# Altium schematic sheet [F_V1]_PowerSheet.SchDoc
size A2; SheetNumber: 2; SheetTotal: 5
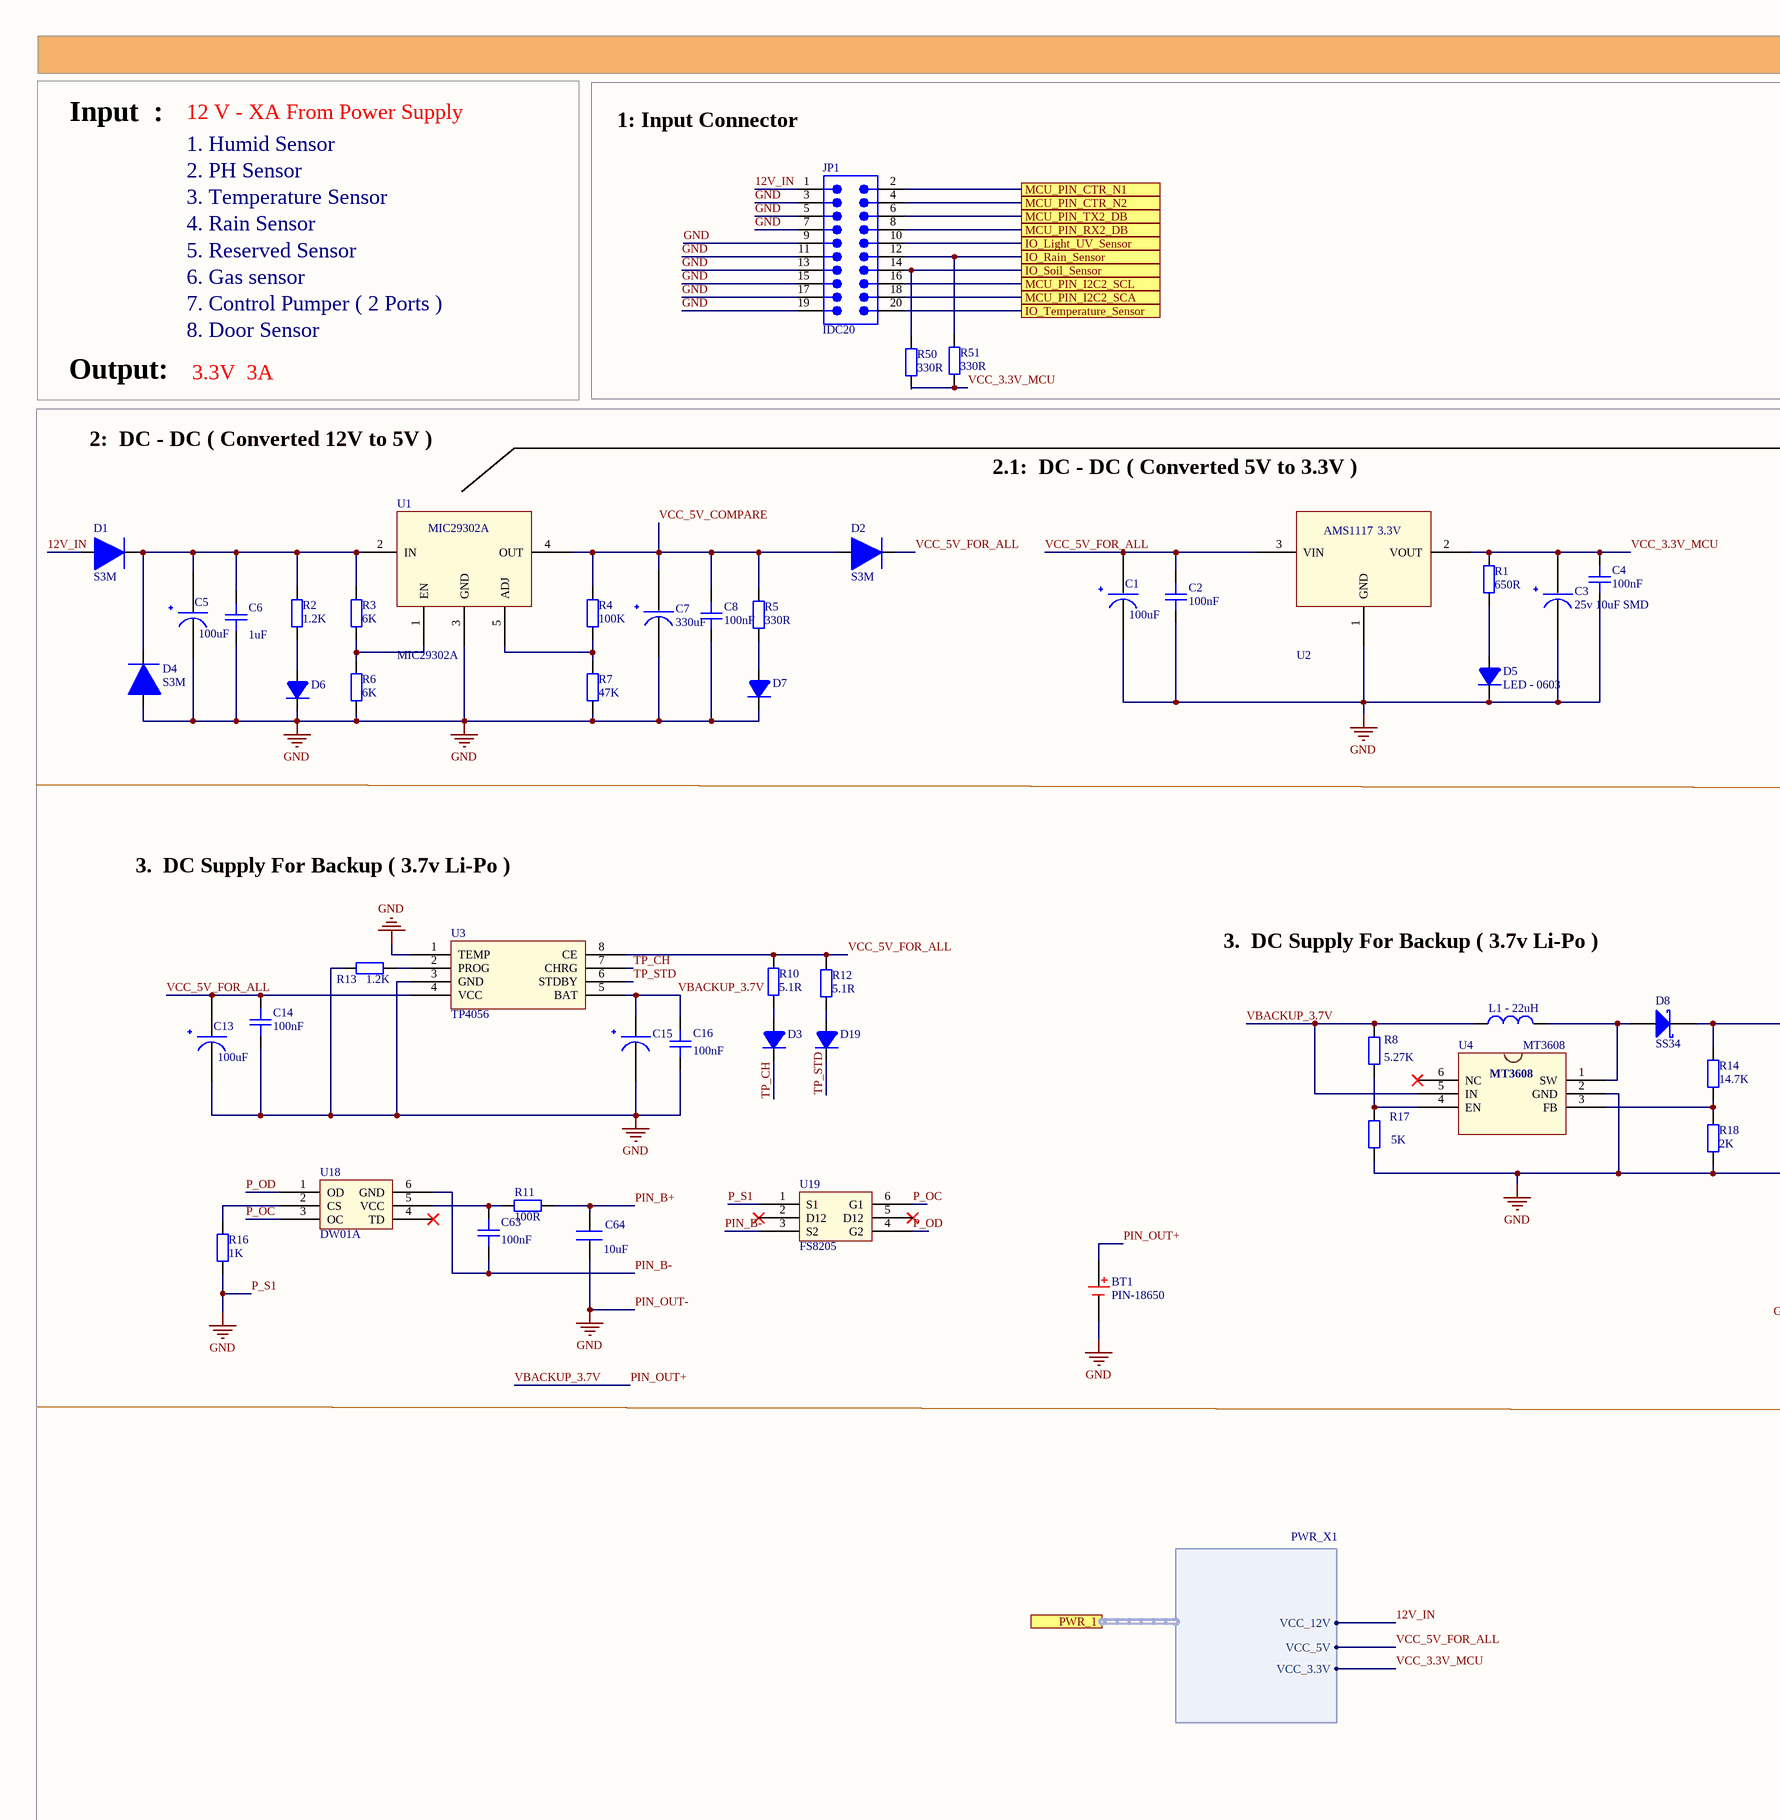
[diagram p0: [F_V1]_PowerSheet.SchDoc, left]
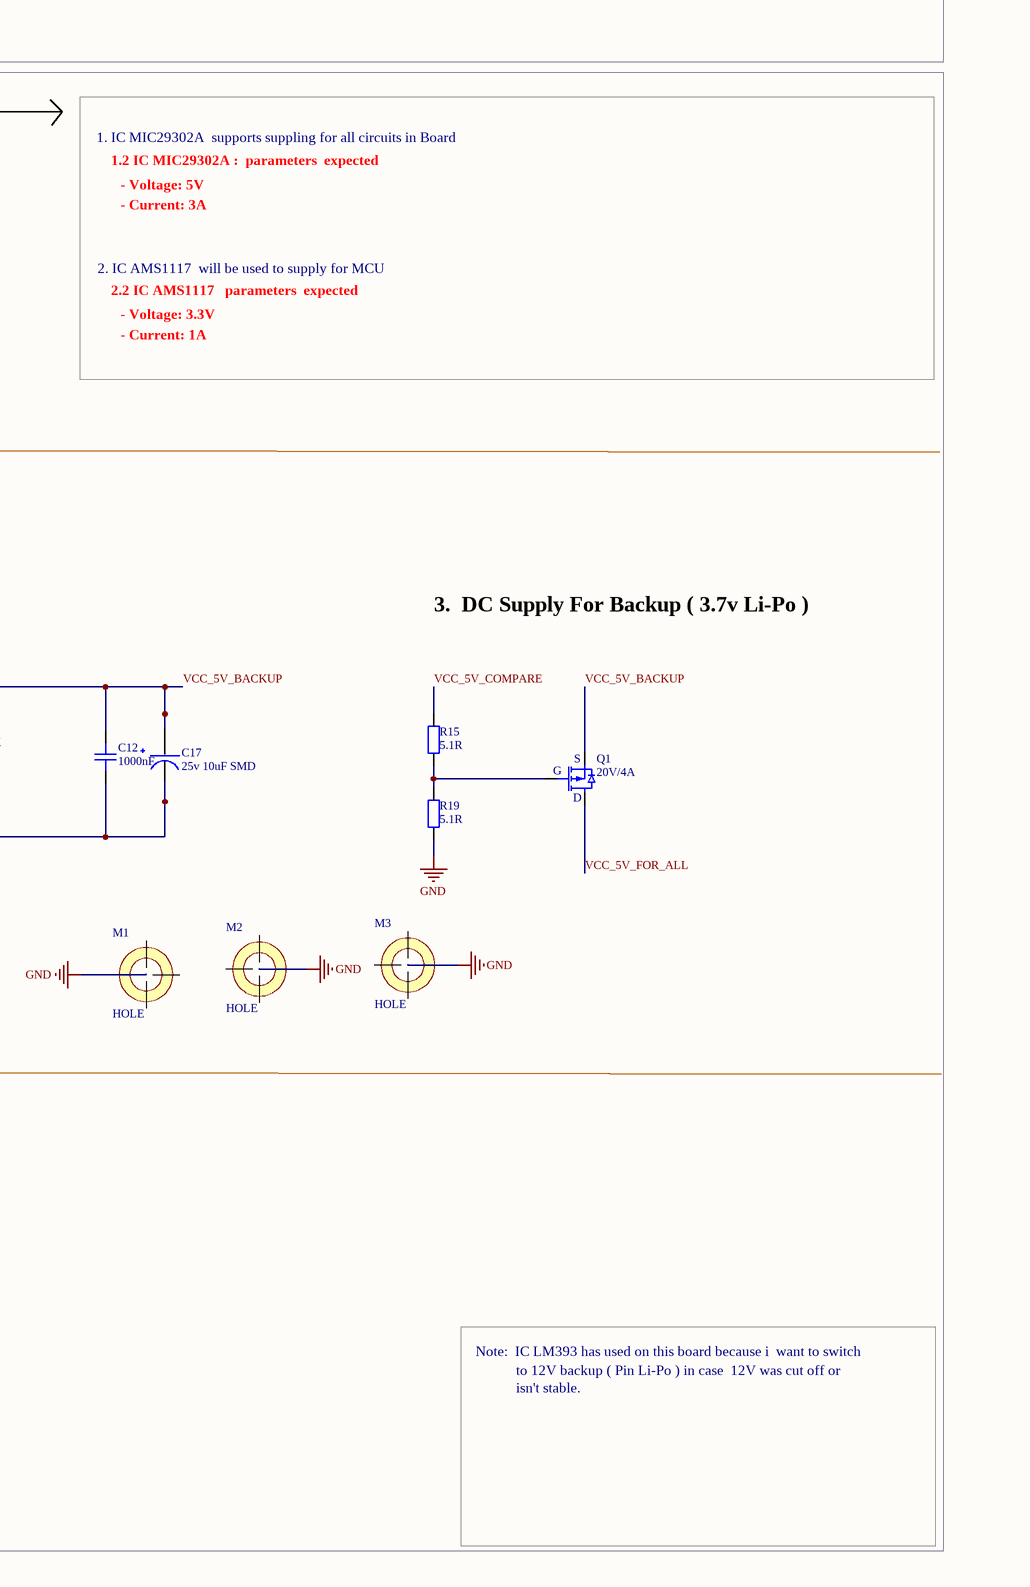
[diagram p1: [F_V1]_PowerSheet.SchDoc, right]

## Parts
BT1  PIN-18650  [PIN]
C1  100uF  [CAPACITOR 6.3x7.7mm]
C2  100nF  [CAPC-0603 (1608)]
C3  25v 10uF SMD  [CAPACITOR 4x5.4mm]
C4  100nF  [CAPC-0603 (1608)]
C5  100uF  [CAPACITOR 6.3x7.7mm]
C6  1uF  [CAPC-0603 (1608)]
C7  330uF  [CAPACITOR 8x10mm SMD]
C8  100nF  [CAPC-0603 (1608)]
C12  1000nF  [CAPC-0603 (1608)]
C13  100uF  [CAPACITOR 6.3x7.7mm]
C14  100nF  [CAPC-0603 (1608)]
C15  25v 10uF SMD  [CAPACITOR 4x5.4mm]  (value not drawn)
C16  100nF  [CAPC-0603 (1608)]
C17  25v 10uF SMD  [CAPACITOR 4x5.4mm]
C63  100nF  [CAPC-0603 (1608)]
C64  10uF  [CAP 10uF SMD 0805]
D1  S3M  [S3M]
D2  S3M  [S3M]
D3  LED - 0603  [LED - 0603]  (value not drawn)
D4  S3M  [S3M]
D5  LED - 0603  [LED - 0603]
D6  LED - 0603  [LED - 0603]  (value not drawn)
D7  LED - 0603  [LED - 0603]  (value not drawn)
D8  SS34  [DIODE_DO214AC_SMA]
D19  LED - 0603  [LED - 0603]  (value not drawn)
JP1  IDC20  [CAPBLE 20]
L1_-_22uH  L-22uH-0530  [INDUCTOR-0630-SMD]  (value not drawn)
M1  HOLE  [HOLE_2MM_5MM]  (no BOM)
M2  HOLE  [HOLE_2MM_5MM]  (no BOM)
M3  HOLE  [HOLE_2MM_5MM]  (no BOM)
Q1  20V/4A  [SOT23_3]
R1  650R  [RESC-0603 (1608)]
R2  1.2K  [RESC-0603 (1608)]
R3  6K  [RESC-0603 (1608)]
R4  100K  [RESC-0603 (1608)]
R5  330R  [RESC-0603 (1608)]
R6  6K  [RESC-0603 (1608)]
R7  47K  [RESC-0603 (1608)]
R8  5.27K  [RESC-0603 (1608)]
R10  5.1R  [RESC-0603 (1608)]
R11  100R  [RESC-0603 (1608)]
R12  5.1R  [RESC-0603 (1608)]
R13  1.2K  [RESC-0603 (1608)]
R14  14.7K  [RESC-0603 (1608)]
R15  5.1R  [RESC-0603 (1608)]
R16  1K  [RESC-0603 (1608)]
R17  5K  [RESC-0603 (1608)]
R18  2K  [RESC-0603 (1608)]
R19  5.1R  [RESC-0603 (1608)]
R50  330R  [RESC-0603 (1608)]
R51  330R  [RESC-0603 (1608)]
U1  MIC29302A  [MIC29302A]
U2  AMS1117 - 3.3V  [AMS1117 -3.3V]  (value not drawn)
U3  TP4056  [TP4056]
U4  MT3608  [MT3608]
U18  DW01A  [DW01A]
U19  FS8205  [FS8205]

## Blocks framed on the sheet
1: Input Connector: JP1 R50 R51

## Ports
IO_Light_UV_Sensor, IO_Rain_Sensor, IO_Soil_Sensor, IO_Temperature_Sensor, MCU_PIN_CTR_N1, MCU_PIN_CTR_N2, MCU_PIN_I2C2_SCA, MCU_PIN_I2C2_SCL, MCU_PIN_RX2_DB, MCU_PIN_TX2_DB, PWR_1 (harness PWR_X1)

## Harnesses
PWR_X1: VCC_12V, VCC_5V, VCC_3.3V

## Nets
GND: BT1.2 C1.2 C2.1 C3.2 C4.1 C5.2 C6.1 C7.2 C8.1 C12.1 C13.2 C14.1 C15.2 C16.1 C17.2 C64.1 D4.1(A) D5.2(K) D6.2(K) D7.2(K) JP1.3 JP1.5 JP1.7 JP1.9 JP1.11 JP1.13 JP1.15 JP1.17 JP1.19 R6.1 R7.1 R13.1 R16.2 R17.2 R18.2 R19.1 U1.3(GND) U2.1(GND) U3.1(TEMP) U3.3(GND) U4.2(GND) U19.1(S1)  [also labelled P_S1, PIN_OUT-]
12V_IN: D1.1(A) JP1.1 ; port PWR_1.VCC_12V
IO_Light_UV_Sensor: JP1.10 ; port IO_Light_UV_Sensor
IO_Rain_Sensor: JP1.12 R51.2 ; port IO_Rain_Sensor
IO_Soil_Sensor: JP1.14 R50.2 ; port IO_Soil_Sensor
IO_Temperature_Sensor: JP1.20 ; port IO_Temperature_Sensor
MCU_PIN_CTR_N1: JP1.2 ; port MCU_PIN_CTR_N1
MCU_PIN_CTR_N2: JP1.4 ; port MCU_PIN_CTR_N2
MCU_PIN_I2C2_SCA: JP1.18 ; port MCU_PIN_I2C2_SCA
MCU_PIN_I2C2_SCL: JP1.16 ; port MCU_PIN_I2C2_SCL
MCU_PIN_RX2_DB: JP1.8 ; port MCU_PIN_RX2_DB
MCU_PIN_TX2_DB: JP1.6 ; port MCU_PIN_TX2_DB
P_OC: U18.3(OC) U19.6(G1)
P_OD: U18.1(OD) U19.4(G2)
PIN_B+: C64.2 R11.2
PIN_B-: C63.1 U18.6(GND) U19.3(S2)
PIN_OUT+: BT1.1 C15.1 C16.2 L1_-_22uH.1 R8.1 U3.5(BAT) U4.5(IN)  [also labelled VBACKUP_3.7V]
TP_CH: D3.2(K) U3.7(CHRG)
TP_STD: D19.2(K) U3.6(STDBY)
VCC_3.3V_MCU: C3.1 C4.2 R1.2 R50.1 R51.1 U2.2(VOUT) ; port PWR_1.VCC_3.3V
VCC_5V_BACKUP: C12.2 C17.1 D8.2(K) Q1.2(S) R14.1
VCC_5V_COMPARE: C7.1 C8.2 D2.1(A) R4.1 R5.2 R15.1 U1.4(OUT)
VCC_5V_FOR_ALL: C1.1 C2.2 C13.1 C14.2 D2.2(K) Q1.3(D) R10.2 R12.2 U2.3(VIN) U3.4(VCC) U3.8(CE) ; port PWR_1.VCC_5V
NetC5_1: C5.1 C6.2 D1.2(K) D4.2(K) R2.2 R3.1 U1.2(IN)
NetC63_2: C63.2 R11.1 U18.5(VCC)
NetD3_1: D3.1(A) R10.1
NetD5_1: D5.1(A) R1.1
NetD6_1: D6.1(A) R2.1
NetD7_1: D7.1(A) R5.1
NetD8_1: D8.1(A) L1_-_22uH.2 U4.1(SW)
NetD19_1: D19.1(A) R12.1
NetQ1_1: Q1.1(G) R15.2 R19.2
NetR3_2: R3.2 R6.2 U1.1(EN)
NetR4_2: R4.2 R7.2 U1.5(ADJ)
NetR8_2: R8.2 R17.1 U4.4(EN)
NetR13_2: R13.2 U3.2(PROG)
NetR14_2: R14.2 R18.1 U4.3(FB)
NetR16_1: R16.1 U18.2(CS)

Not connected (* = marked no-connect by the designer): U4 6(NC)*; U18 4(TD)*; U19 2(D12)* 5(D12)*

## Notes on the sheet
- Input  :
- 12 V - XA From Power Supply
- 1. Humid Sensor
- 2. PH Sensor
- 3. Temperature Sensor
- 4. Rain Sensor
- 5. Reserved Sensor
- 6. Gas sensor
- 7. Control Pumper ( 2 Ports )
- Output:
- 8. Door Sensor
- 3.3V  3A
- 2:  DC - DC ( Converted 12V to 5V )
- 2.1:  DC - DC ( Converted 5V to 3.3V )
- 1. IC MIC29302A  supports suppling for all circuits in Board
- 1.2 IC MIC29302A :  parameters  expected
- - Voltage: 5V
- - Current: 3A
- 2. IC AMS1117  will be used to supply for MCU
- 2.2 IC AMS1117   parameters  expected
- - Voltage: 3.3V
- - Current: 1A
- 3.  DC Supply For Backup ( 3.7v Li-Po )
- Note:  IC LM393 has used on this board because i  want to switch
- to 12V backup ( Pin Li-Po ) in case  12V was cut off or
- isn't stable.
- (in symbol AMS1117 - 3.3V) AMS1117; 3.3V

## Library data of the parts
C1 C5 C13 = 25V 100uF SMD
C2 C4 C6 C8 C12 C14 C16 C63 = CAPC NF 0603: CAP SMD, Not Fill, 0603; Value: NF; Solder: Not Fill; Category: CAPACITOR
C7 = 25V 330uF SMD
C64 = CAP 0805 10uF SMD
D8 = SS34: DIODE SCHOTTKY 40V 3A SMA; Solder: SMT; MPN: SS34; Value: SS34; MFR: *
JP1 = CAPBLE 20: Flat Cable Connector (IDC), Standard Male Header, Straight Press-in Pin, 20 Contacts, Performance Level 2; PCB_Layout: Complies with manufacturer's recommendation.; DrillSize: Corresponds to nominal value.; Published: 15-Nov-2004; PackageDocument: Feb-2000; PackageReference: 918520x329; Publisher: Altium Limited; ComponentLink1Description: Manufacturer Link; ComponentLink1URL: http://www.harting.com/; ComponentLink2Description: Packaging Specification; ComponentLink2URL: http://www.harkis.harting.com/_sek/pdf/TB_0918520x329_BL01_R32154.pdf
M1-M3 = HOLE_2_4/2_5/3_5/3_6: HOLE 2_4/2_5/3_5/3_6; MPN: None; Solder: Not Fill; CompanyID: VT-; ClassName: MECH_HOLE; Value: HOLE
Q1 = AO3415: MOSFET P-CH 20V 4A SOT23; MFR: Alpha & Omega Semiconductor Inc.; Solder: SMT; Value: 20V/4A; MPN: AO3415
R1-R8 R11 R13 R14 R16-R18 R50 R51 = CRCW06035R10FKEA: RES SMD 5.1 OHM 1% 1/10W 0603; MFR: Vishay Dale; Value: 5.1R; Solder: SMT; MPN: CRCW06035R10FKEA; Category: RESISTOR; PinCount: 2
R10 R12 R15 R19 = CRCW06035R10FKEA: RES SMD 5.1 OHM 1% 1/10W 0603; MFR: Vishay Dale; Solder: SMT; Value: 5.1R; MPN: CRCW06035R10FKEA; Category: RESISTOR; PinCount: 2